# Altium schematic sheet 5-QSPF.SchDoc
size A2; SheetNumber: 5; SheetTotal: 5
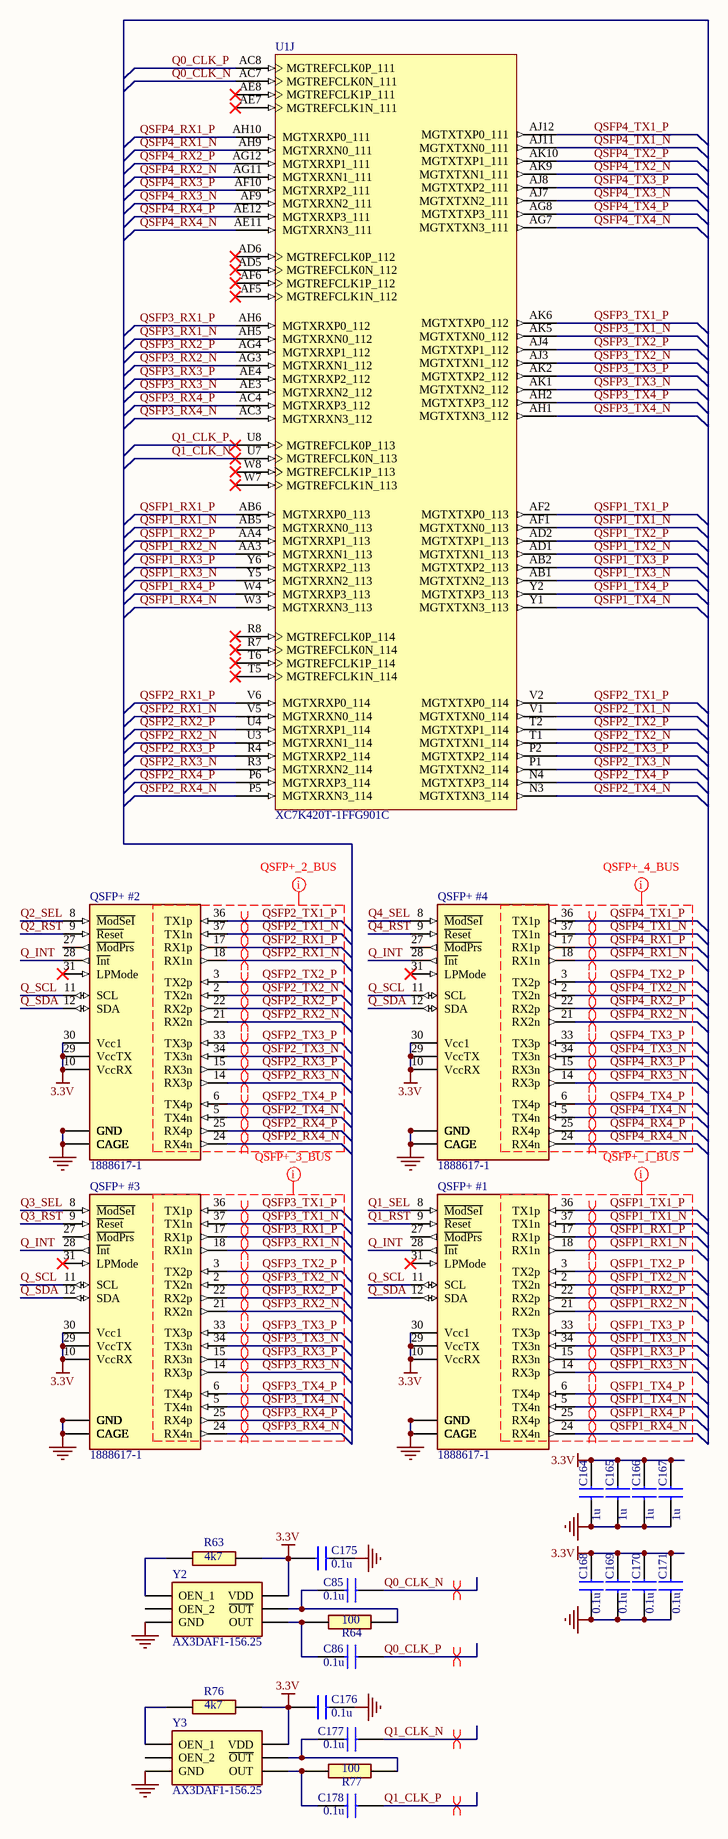
[diagram p0: 5-QSPF.SchDoc]

## Parts
C85  0.1u  [SMD0402]
C86  0.1u  [SMD0402]
C164  1u  [SMD0402]
C165  1u  [SMD0402]
C166  1u  [SMD0402]
C167  1u  [SMD0402]
C168  0.1u  [SMD0402]
C169  0.1u  [SMD0402]
C170  0.1u  [SMD0402]
C171  0.1u  [SMD0402]
C175  0.1u  [SMD0402]
C176  0.1u  [SMD0402]
C177  0.1u  [SMD0402]
C178  0.1u  [SMD0402]
QSFP+_#1  1888617-1  [18886171]
QSFP+_#2  1888617-1  [18886171]
QSFP+_#3  1888617-1  [18886171]
QSFP+_#4  1888617-1  [18886171]
R63  4k7  [SMD0402]
R64  100  [SMD0402]
R76  4k7  [SMD0402]
R77  100  [SMD0402]
U1  XC7K420T-1FFG901C  [FFG901]  (part J of 16)
Y2  AX3DAF1-156.25  [AX3DAF11000000]
Y3  AX3DAF1-156.25  [AX3DAF11000000]

## Nets
3.3V: C164.2 C165.2 C166.2 C167.2 C168.2 C169.2 C170.2 C171.2 C175.1 C176.1 QSFP+_#1.10(VccRX) QSFP+_#1.29(VccTX) QSFP+_#1.30(Vcc1) QSFP+_#2.10(VccRX) QSFP+_#2.29(VccTX) QSFP+_#2.30(Vcc1) QSFP+_#3.10(VccRX) QSFP+_#3.29(VccTX) QSFP+_#3.30(Vcc1) QSFP+_#4.10(VccRX) QSFP+_#4.29(VccTX) QSFP+_#4.30(Vcc1) R63.2 R76.2 Y2.6(VDD) Y3.6(VDD)
GND: C164.1 C165.1 C166.1 C167.1 C168.1 C169.1 C170.1 C171.1 C175.2 C176.2 QSFP+_#1.1(GND) QSFP+_#1.4(GND) QSFP+_#1.7(GND) QSFP+_#1.13(GND) QSFP+_#1.16(GND) QSFP+_#1.19(GND) QSFP+_#1.20(GND) QSFP+_#1.23(GND) QSFP+_#1.26(GND) QSFP+_#1.32(GND) QSFP+_#1.35(GND) QSFP+_#1.38(GND) QSFP+_#1.MH1(CAGE) QSFP+_#1.MH2(CAGE) QSFP+_#1.MH3(CAGE) QSFP+_#1.MH4(CAGE) QSFP+_#1.MH5(CAGE) QSFP+_#1.MH6(CAGE) QSFP+_#1.MH7(CAGE) QSFP+_#1.MH8(CAGE) QSFP+_#1.MH9(CAGE) QSFP+_#1.MH10(CAGE) QSFP+_#1.MH11(CAGE) QSFP+_#1.MH12(CAGE) QSFP+_#1.MH13(CAGE) QSFP+_#1.MH14(CAGE) QSFP+_#2.1(GND) QSFP+_#2.4(GND) QSFP+_#2.7(GND) QSFP+_#2.13(GND) QSFP+_#2.16(GND) QSFP+_#2.19(GND) QSFP+_#2.20(GND) QSFP+_#2.23(GND) QSFP+_#2.26(GND) QSFP+_#2.32(GND) QSFP+_#2.35(GND) QSFP+_#2.38(GND) QSFP+_#2.MH1(CAGE) QSFP+_#2.MH2(CAGE) QSFP+_#2.MH3(CAGE) QSFP+_#2.MH4(CAGE) QSFP+_#2.MH5(CAGE) QSFP+_#2.MH6(CAGE) QSFP+_#2.MH7(CAGE) QSFP+_#2.MH8(CAGE) QSFP+_#2.MH9(CAGE) QSFP+_#2.MH10(CAGE) QSFP+_#2.MH11(CAGE) QSFP+_#2.MH12(CAGE) QSFP+_#2.MH13(CAGE) QSFP+_#2.MH14(CAGE) QSFP+_#3.1(GND) QSFP+_#3.4(GND) QSFP+_#3.7(GND) QSFP+_#3.13(GND) QSFP+_#3.16(GND) QSFP+_#3.19(GND) QSFP+_#3.20(GND) QSFP+_#3.23(GND) QSFP+_#3.26(GND) QSFP+_#3.32(GND) QSFP+_#3.35(GND) QSFP+_#3.38(GND) QSFP+_#3.MH1(CAGE) QSFP+_#3.MH2(CAGE) QSFP+_#3.MH3(CAGE) QSFP+_#3.MH4(CAGE) QSFP+_#3.MH5(CAGE) QSFP+_#3.MH6(CAGE) QSFP+_#3.MH7(CAGE) QSFP+_#3.MH8(CAGE) QSFP+_#3.MH9(CAGE) QSFP+_#3.MH10(CAGE) QSFP+_#3.MH11(CAGE) QSFP+_#3.MH12(CAGE) QSFP+_#3.MH13(CAGE) QSFP+_#3.MH14(CAGE) QSFP+_#4.1(GND) QSFP+_#4.4(GND) QSFP+_#4.7(GND) QSFP+_#4.13(GND) QSFP+_#4.16(GND) QSFP+_#4.19(GND) QSFP+_#4.20(GND) QSFP+_#4.23(GND) QSFP+_#4.26(GND) QSFP+_#4.32(GND) QSFP+_#4.35(GND) QSFP+_#4.38(GND) QSFP+_#4.MH1(CAGE) QSFP+_#4.MH2(CAGE) QSFP+_#4.MH3(CAGE) QSFP+_#4.MH4(CAGE) QSFP+_#4.MH5(CAGE) QSFP+_#4.MH6(CAGE) QSFP+_#4.MH7(CAGE) QSFP+_#4.MH8(CAGE) QSFP+_#4.MH9(CAGE) QSFP+_#4.MH10(CAGE) QSFP+_#4.MH11(CAGE) QSFP+_#4.MH12(CAGE) QSFP+_#4.MH13(CAGE) QSFP+_#4.MH14(CAGE) Y2.3(GND) Y3.3(GND)
Q0_CLK_N: C85.2 U1.AC7(MGTREFCLK0N_111)
Q0_CLK_P: C86.2 U1.AC8(MGTREFCLK0P_111)
Q1_CLK_N: C177.2 U1.U7(MGTREFCLK0N_113)
Q1_CLK_P: C178.2 U1.U8(MGTREFCLK0P_113)
Q1_RST: QSFP+_#1.9(~{Reset})
Q1_SEL: QSFP+_#1.8(~{ModSeI})
Q2_RST: QSFP+_#2.9(~{Reset})
Q2_SEL: QSFP+_#2.8(~{ModSeI})
Q3_RST: QSFP+_#3.9(~{Reset})
Q3_SEL: QSFP+_#3.8(~{ModSeI})
Q4_RST: QSFP+_#4.9(~{Reset})
Q4_SEL: QSFP+_#4.8(~{ModSeI})
Q_INT: QSFP+_#1.28(~{Int}) QSFP+_#2.28(~{Int}) QSFP+_#3.28(~{Int}) QSFP+_#4.28(~{Int})
Q_SCL: QSFP+_#1.11(SCL) QSFP+_#2.11(SCL) QSFP+_#3.11(SCL) QSFP+_#4.11(SCL)
Q_SDA: QSFP+_#1.12(SDA) QSFP+_#2.12(SDA) QSFP+_#3.12(SDA) QSFP+_#4.12(SDA)
QSFP1_RX1_N: QSFP+_#1.18(RX1n) U1.AB5(MGTXRXN0_113)
QSFP1_RX1_P: QSFP+_#1.17(RX1p) U1.AB6(MGTXRXP0_113)
QSFP1_RX2_N: QSFP+_#1.21(RX2n) U1.AA3(MGTXRXN1_113)
QSFP1_RX2_P: QSFP+_#1.22(RX2p) U1.AA4(MGTXRXP1_113)
QSFP1_RX3_N: QSFP+_#1.14(RX3p) U1.Y5(MGTXRXN2_113)
QSFP1_RX3_P: QSFP+_#1.15(RX3n) U1.Y6(MGTXRXP2_113)
QSFP1_RX4_N: QSFP+_#1.24(RX4n) U1.W3(MGTXRXN3_113)
QSFP1_RX4_P: QSFP+_#1.25(RX4p) U1.W4(MGTXRXP3_113)
QSFP1_TX1_N: QSFP+_#1.37(TX1n) U1.AF1(MGTXTXN0_113)
QSFP1_TX1_P: QSFP+_#1.36(TX1p) U1.AF2(MGTXTXP0_113)
QSFP1_TX2_N: QSFP+_#1.2(TX2n) U1.AD1(MGTXTXN1_113)
QSFP1_TX2_P: QSFP+_#1.3(TX2p) U1.AD2(MGTXTXP1_113)
QSFP1_TX3_N: QSFP+_#1.34(TX3n) U1.AB1(MGTXTXN2_113)
QSFP1_TX3_P: QSFP+_#1.33(TX3p) U1.AB2(MGTXTXP2_113)
QSFP1_TX4_N: QSFP+_#1.5(TX4n) U1.Y1(MGTXTXN3_113)
QSFP1_TX4_P: QSFP+_#1.6(TX4p) U1.Y2(MGTXTXP3_113)
QSFP2_RX1_N: QSFP+_#2.18(RX1n) U1.V5(MGTXRXN0_114)
QSFP2_RX1_P: QSFP+_#2.17(RX1p) U1.V6(MGTXRXP0_114)
QSFP2_RX2_N: QSFP+_#2.21(RX2n) U1.U3(MGTXRXN1_114)
QSFP2_RX2_P: QSFP+_#2.22(RX2p) U1.U4(MGTXRXP1_114)
QSFP2_RX3_N: QSFP+_#2.14(RX3p) U1.R3(MGTXRXN2_114)
QSFP2_RX3_P: QSFP+_#2.15(RX3n) U1.R4(MGTXRXP2_114)
QSFP2_RX4_N: QSFP+_#2.24(RX4n) U1.P5(MGTXRXN3_114)
QSFP2_RX4_P: QSFP+_#2.25(RX4p) U1.P6(MGTXRXP3_114)
QSFP2_TX1_N: QSFP+_#2.37(TX1n) U1.V1(MGTXTXN0_114)
QSFP2_TX1_P: QSFP+_#2.36(TX1p) U1.V2(MGTXTXP0_114)
QSFP2_TX2_N: QSFP+_#2.2(TX2n) U1.T1(MGTXTXN1_114)
QSFP2_TX2_P: QSFP+_#2.3(TX2p) U1.T2(MGTXTXP1_114)
QSFP2_TX3_N: QSFP+_#2.34(TX3n) U1.P1(MGTXTXN2_114)
QSFP2_TX3_P: QSFP+_#2.33(TX3p) U1.P2(MGTXTXP2_114)
QSFP2_TX4_N: QSFP+_#2.5(TX4n) U1.N3(MGTXTXN3_114)
QSFP2_TX4_P: QSFP+_#2.6(TX4p) U1.N4(MGTXTXP3_114)
QSFP3_RX1_N: QSFP+_#3.18(RX1n) U1.AH5(MGTXRXN0_112)
QSFP3_RX1_P: QSFP+_#3.17(RX1p) U1.AH6(MGTXRXP0_112)
QSFP3_RX2_N: QSFP+_#3.21(RX2n) U1.AG3(MGTXRXN1_112)
QSFP3_RX2_P: QSFP+_#3.22(RX2p) U1.AG4(MGTXRXP1_112)
QSFP3_RX3_N: QSFP+_#3.14(RX3p) U1.AE3(MGTXRXN2_112)
QSFP3_RX3_P: QSFP+_#3.15(RX3n) U1.AE4(MGTXRXP2_112)
QSFP3_RX4_N: QSFP+_#3.24(RX4n) U1.AC3(MGTXRXN3_112)
QSFP3_RX4_P: QSFP+_#3.25(RX4p) U1.AC4(MGTXRXP3_112)
QSFP3_TX1_N: QSFP+_#3.37(TX1n) U1.AK5(MGTXTXN0_112)
QSFP3_TX1_P: QSFP+_#3.36(TX1p) U1.AK6(MGTXTXP0_112)
QSFP3_TX2_N: QSFP+_#3.2(TX2n) U1.AJ3(MGTXTXN1_112)
QSFP3_TX2_P: QSFP+_#3.3(TX2p) U1.AJ4(MGTXTXP1_112)
QSFP3_TX3_N: QSFP+_#3.34(TX3n) U1.AK1(MGTXTXN2_112)
QSFP3_TX3_P: QSFP+_#3.33(TX3p) U1.AK2(MGTXTXP2_112)
QSFP3_TX4_N: QSFP+_#3.5(TX4n) U1.AH1(MGTXTXN3_112)
QSFP3_TX4_P: QSFP+_#3.6(TX4p) U1.AH2(MGTXTXP3_112)
QSFP4_RX1_N: QSFP+_#4.18(RX1n) U1.AH9(MGTXRXN0_111)
QSFP4_RX1_P: QSFP+_#4.17(RX1p) U1.AH10(MGTXRXP0_111)
QSFP4_RX2_N: QSFP+_#4.21(RX2n) U1.AG11(MGTXRXN1_111)
QSFP4_RX2_P: QSFP+_#4.22(RX2p) U1.AG12(MGTXRXP1_111)
QSFP4_RX3_N: QSFP+_#4.14(RX3p) U1.AF9(MGTXRXN2_111)
QSFP4_RX3_P: QSFP+_#4.15(RX3n) U1.AF10(MGTXRXP2_111)
QSFP4_RX4_N: QSFP+_#4.24(RX4n) U1.AE11(MGTXRXN3_111)
QSFP4_RX4_P: QSFP+_#4.25(RX4p) U1.AE12(MGTXRXP3_111)
QSFP4_TX1_N: QSFP+_#4.37(TX1n) U1.AJ11(MGTXTXN0_111)
QSFP4_TX1_P: QSFP+_#4.36(TX1p) U1.AJ12(MGTXTXP0_111)
QSFP4_TX2_N: QSFP+_#4.2(TX2n) U1.AK9(MGTXTXN1_111)
QSFP4_TX2_P: QSFP+_#4.3(TX2p) U1.AK10(MGTXTXP1_111)
QSFP4_TX3_N: QSFP+_#4.34(TX3n) U1.AJ7(MGTXTXN2_111)
QSFP4_TX3_P: QSFP+_#4.33(TX3p) U1.AJ8(MGTXTXP2_111)
QSFP4_TX4_N: QSFP+_#4.5(TX4n) U1.AG7(MGTXTXN3_111)
QSFP4_TX4_P: QSFP+_#4.6(TX4p) U1.AG8(MGTXTXP3_111)
NetC85_1: C85.1 R64.1 Y2.5(~{OUT})
NetC86_1: C86.1 R64.2 Y2.4(OUT)
NetC177_1: C177.1 R77.1 Y3.5(~{OUT})
NetC178_1: C178.1 R77.2 Y3.4(OUT)
NetR63_1: R63.1 Y2.1(OEN_1)
NetR76_1: R76.1 Y3.1(OEN_1)

Not connected (* = marked no-connect by the designer): QSFP+_#1 27(~{ModPrs}) 31(LPMode)*; QSFP+_#2 27(~{ModPrs}) 31(LPMode)*; QSFP+_#3 27(~{ModPrs}) 31(LPMode)*; QSFP+_#4 27(~{ModPrs}) 31(LPMode)*; U1 AD5(MGTREFCLK0N_112)* AD6(MGTREFCLK0P_112)* AE7(MGTREFCLK1N_111)* AE8(MGTREFCLK1P_111)* AF5(MGTREFCLK1N_112)* AF6(MGTREFCLK1P_112)* R7(MGTREFCLK0N_114)* R8(MGTREFCLK0P_114)* T5(MGTREFCLK1N_114)* T6(MGTREFCLK1P_114)* W7(MGTREFCLK1N_113)* W8(MGTREFCLK1P_113)*; Y2 2(OEN_2); Y3 2(OEN_2)

## Layout directives
differential pair; differential pair class QSFP+_1_DIF: QSFP1_RX1_N, QSFP1_RX1_P, QSFP1_RX2_N, QSFP1_RX2_P, QSFP1_RX3_N, QSFP1_RX3_P, QSFP1_RX4_N, QSFP1_RX4_P, QSFP1_TX1_N, QSFP1_TX1_P, QSFP1_TX2_N, QSFP1_TX2_P, QSFP1_TX3_N, QSFP1_TX3_P, QSFP1_TX4_N, QSFP1_TX4_P
differential pair; differential pair class QSFP+_4_DIF: QSFP4_RX1_N, QSFP4_RX1_P, QSFP4_RX2_N, QSFP4_RX2_P, QSFP4_RX3_N, QSFP4_RX3_P, QSFP4_RX4_N, QSFP4_RX4_P, QSFP4_TX1_N, QSFP4_TX1_P, QSFP4_TX2_N, QSFP4_TX2_P, QSFP4_TX3_N, QSFP4_TX3_P, QSFP4_TX4_N, QSFP4_TX4_P
net class QSFP+_4_BUS: QSFP4_RX1_N, QSFP4_RX1_P, QSFP4_RX2_N, QSFP4_RX2_P, QSFP4_RX3_N, QSFP4_RX3_P, QSFP4_RX4_N, QSFP4_RX4_P, QSFP4_TX1_N, QSFP4_TX1_P, QSFP4_TX2_N, QSFP4_TX2_P, QSFP4_TX3_N, QSFP4_TX3_P, QSFP4_TX4_N, QSFP4_TX4_P
net class QSFP+_1_BUS: QSFP1_RX1_N, QSFP1_RX1_P, QSFP1_RX2_N, QSFP1_RX2_P, QSFP1_RX3_N, QSFP1_RX3_P, QSFP1_RX4_N, QSFP1_RX4_P, QSFP1_TX1_N, QSFP1_TX1_P, QSFP1_TX2_N, QSFP1_TX2_P, QSFP1_TX3_N, QSFP1_TX3_P, QSFP1_TX4_N, QSFP1_TX4_P
differential pair; differential pair class QSFP+_3_DIF: QSFP3_RX1_N, QSFP3_RX1_P, QSFP3_RX2_N, QSFP3_RX2_P, QSFP3_RX3_N, QSFP3_RX3_P, QSFP3_RX4_N, QSFP3_RX4_P, QSFP3_TX1_N, QSFP3_TX1_P, QSFP3_TX2_N, QSFP3_TX2_P, QSFP3_TX3_N, QSFP3_TX3_P, QSFP3_TX4_N, QSFP3_TX4_P
differential pair; differential pair class QSFP+_2_DIF: QSFP2_RX1_N, QSFP2_RX1_P, QSFP2_RX2_N, QSFP2_RX2_P, QSFP2_RX3_N, QSFP2_RX3_P, QSFP2_RX4_N, QSFP2_RX4_P, QSFP2_TX1_N, QSFP2_TX1_P, QSFP2_TX2_N, QSFP2_TX2_P, QSFP2_TX3_N, QSFP2_TX3_P, QSFP2_TX4_N, QSFP2_TX4_P
net class QSFP+_2_BUS: QSFP2_RX1_N, QSFP2_RX1_P, QSFP2_RX2_N, QSFP2_RX2_P, QSFP2_RX3_N, QSFP2_RX3_P, QSFP2_RX4_N, QSFP2_RX4_P, QSFP2_TX1_N, QSFP2_TX1_P, QSFP2_TX2_N, QSFP2_TX2_P, QSFP2_TX3_N, QSFP2_TX3_P, QSFP2_TX4_N, QSFP2_TX4_P
net class QSFP+_3_BUS: QSFP3_RX1_N, QSFP3_RX1_P, QSFP3_RX2_N, QSFP3_RX2_P, QSFP3_RX3_N, QSFP3_RX3_P, QSFP3_RX4_N, QSFP3_RX4_P, QSFP3_TX1_N, QSFP3_TX1_P, QSFP3_TX2_N, QSFP3_TX2_P, QSFP3_TX3_N, QSFP3_TX3_P, QSFP3_TX4_N, QSFP3_TX4_P
differential pair: Q0_CLK_N, Q0_CLK_P, Q1_CLK_N, Q1_CLK_P

## Library data of the parts
C85 C86 C164-C171 C175-C178 = CAP 0402: Capacitor
QSFP+_#1-QSFP+_#4 = 1888617-1: Connector; Manufacturer_Name: TE Connectivity; Datasheet Link: https://www.mouser.com/datasheet/2/418/NG_CS_1773408-1_Pluggable_IXO_Solutions_-_QSFP_061-1244175.pdf; Height: 9.7mm; Manufacturer_Part_Number: 1888617-1; Arrow Part Number: 1888617-1; Arrow Price/Stock: https://www.arrow.com/en/products/1888617-1/te-connectivity; Mouser Part Number: 571-1888617-1; Mouser Price/Stock: https://www.mouser.com/Search/Refine.aspx?Keyword=571-1888617-1
R63 R64 R76 R77 = RES 0402: Resistor
U1 = XC7K420T-1FFG901C: Kintex-7 FPGA, 400 User I/Os, 28 GTX, 900-Ball BGA, Speed Grade 1, Commercial Grade, Pb-Free; Manufacturer: Xilinx; GTX: 28; SelectIO HP: 0; SelectIO HR: 380; Speed Grade: -1; DatasheetVersion: v1.12; PackageVersion: Rev 1.8; PackageReference: FFG901; PackageDescription: Flip-Chip BGA, Body 31 x 31 mm, 1.0 mm Pitch; Generic Part Number: XC7K420T; RoHS: Pb-Free; Mounting Technology: Surface Mount; Code_JEDEC: MS-034-AAN-1; PartNumber: XC7K420T-1FFG901C; ComponentLink1Description: Datasheet; ComponentLink1URL: http://www.xilinx.com/support/documentation/data_sheets/ds180_7Series_Overview.pdf; ComponentLink2Description: Package Specification; ComponentLink2URL: http://www.xilinx.com/support/documentation/user_guides/ug475_7Series_Pkg_Pinout.pdf
Y2 Y3 = AX3DAF1-100.0000: Crystal or Oscillator; Manufacturer_Name: ABRACON; Datasheet Link: https://abracon.com/datasheets/AX3.pdf; Height: 1.1mm; Manufacturer_Part_Number: AX3DAF1-100.0000; Mouser Part Number: 815-AX3DAF1-100.0000; Mouser Price/Stock: https://www.mouser.com/Search/Refine.aspx?Keyword=815-AX3DAF1-100.0000; Arrow Part Number: AX3DAF1-100.0000; Arrow Price/Stock: https://www.arrow.com/en/products/ax3daf1-100.0000/abracon